# Altium schematic sheet 电子脚铐本体主控板.SchDoc
size A4
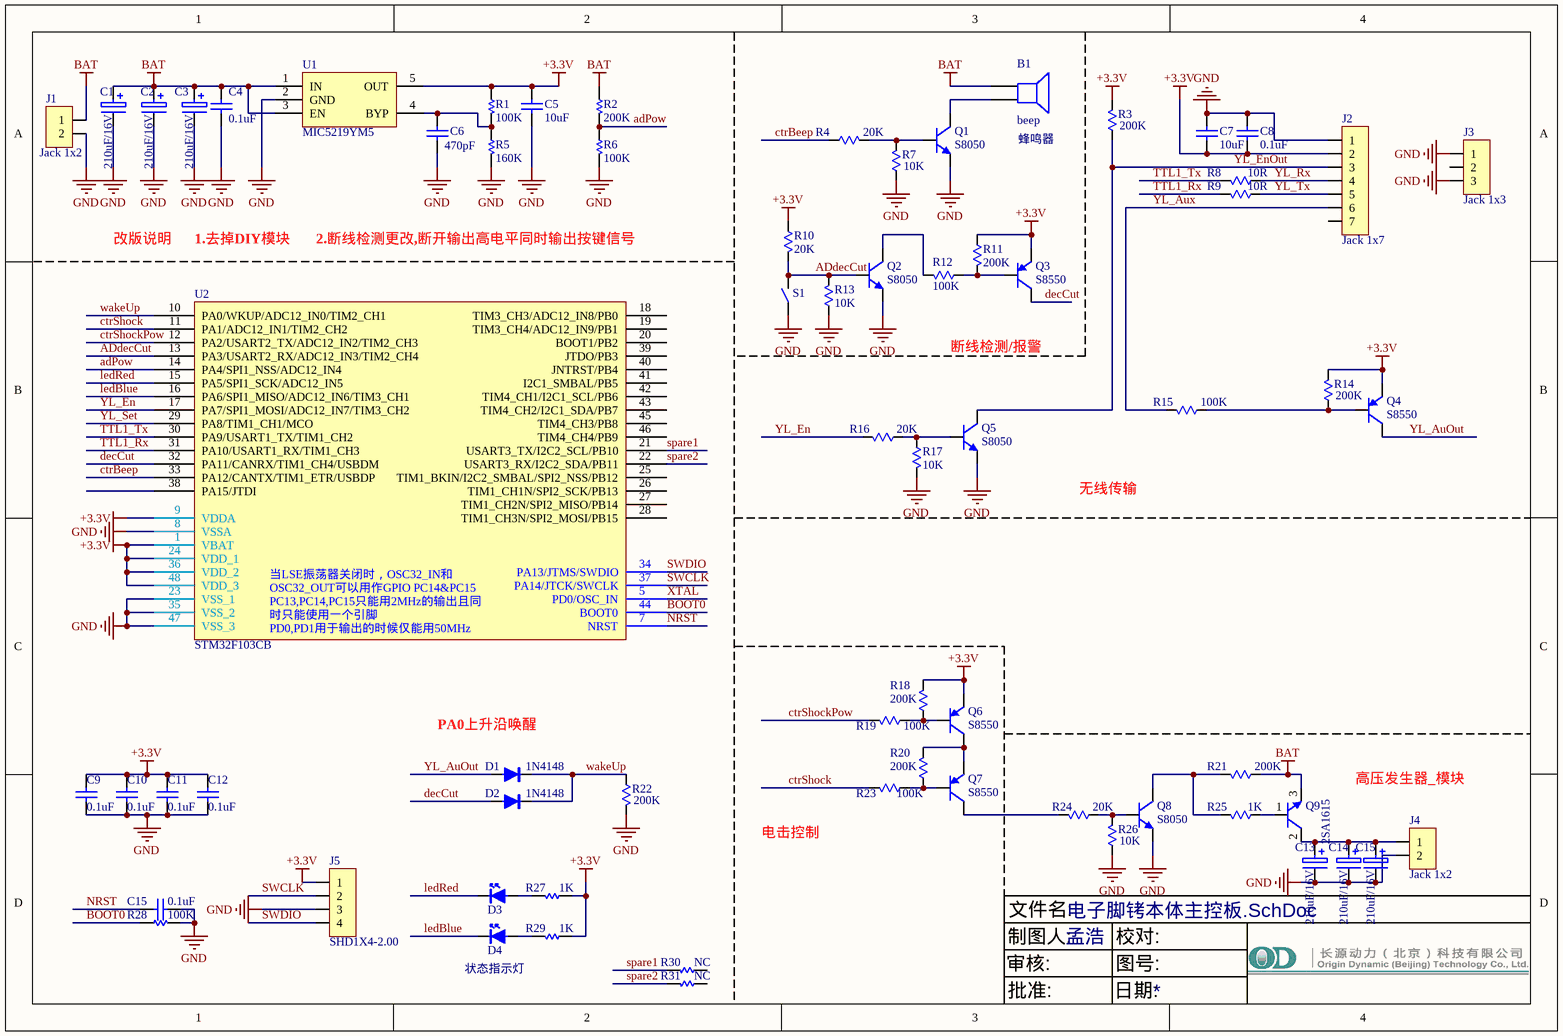
[diagram p0: 电子脚铐本体主控板.SchDoc]

## Parts
(Parts that share a designator on the sheet are numbered #1, #2 ... from top to bottom, then left to right.)
B1  beep  [Jk1*2-2.0]
C1  210uF/16V  [C7343]
C2  210uF/16V  [C7343]
C3  210uF/16V  [C7343]
C4  0.1uF  [C0603]
C5  10uF  [C0603]
C6  470pF  [C0603]
C7  10uF  [C0603]
C8  0.1uF  [C0603]
C9  0.1uF  [C0603]
C10  0.1uF  [C0603]
C11  0.1uF  [C0603]
C12  0.1uF  [C0603]
C13  210uF/16V  [C7343]
C14  210uF/16V  [C7343]
C15#1  210uF/16V  [C7343]
C15#2  0.1uF  [C0603]
D1  1N4148  [SOD-80-S]
D2  1N4148  [SOD-80-S]
D3  LED  [Jk1*2-2.0]  (value not drawn)
D4  LED  [Jk1*2-2.0]  (value not drawn)
J1  Jack 1x2  [HDR1X2]
J2  Jack 1x7  [Jk1*7-2.0]
J3  Jack 1x3  [Jk1*3-2.0]
J4  Jack 1x2  [HDR1X2]
J5  SHD1X4-2.00  [Jk1*4-2.0]
Q1  S8050  [SOT-23]
Q2  S8050  [SOT-23]
Q3  S8550  [SOT-23]
Q4  S8550  [SOT-23]
Q5  S8050  [SOT-23]
Q6  S8550  [SOT-23]
Q7  S8550  [SOT-23]
Q8  S8050  [SOT-23]
Q9  2SA1615  [TO-252]
R1  100K  [R0603]
R2  200K  [R0603]
R3  200K  [R0603]
R4  20K  [R0603]
R5  160K  [R0603]
R6  100K  [R0603]
R7  10K  [R0603]
R8  10R  [R0603]
R9  10R  [R0603]
R10  20K  [R0603]
R11  200K  [R0603]
R12  100K  [R0603]
R13  10K  [R0603]
R14  200K  [R0603]
R15  100K  [R0603]
R16  20K  [R0603]
R17  10K  [R0603]
R18  200K  [R0603]
R19  100K  [R0603]
R20  200K  [R0603]
R21  200K  [R0603]
R22  200K  [R0603]
R23  100K  [R0603]
R24  20K  [R0603]
R25  1K  [R0603]
R26  10K  [R0603]
R27  1K  [R0603]
R28  100K  [R0603]
R29  1K  [R0603]
R30  NC  [R0603]
R31  NC  [R0603]
S1  Switch  [Jk1*2-2.0]  (value not drawn)
U1  MIC5219YM5  [SOT-23-5]
U2  STM32F103CB  [LQFP48]

## Nets
+3.3V: C5.1 C7.1 C8.1 C9.1 C10.1 C11.1 C12.1 J2.2 J5.1 Q3.2(e) Q4.2(e) Q6.2(e) R1.1 R3.2 R10.1 R11.1 R14.2 R18.2 R27.1 R29.1 U1.5(OUT) U2.1(VBAT) U2.9(VDDA) U2.24(VDD_1) U2.36(VDD_2) U2.48(VDD_3)
BAT: B1.1 C1.1 C2.1 C3.1 C4.2 J1.1 Q9.3(E) R2.1 R21.1 U1.1(IN) U1.3(EN)
GND: C1.2 C2.2 C3.2 C4.1 C5.2 C6.2 C7.2 C8.2 C9.2 C10.2 C11.2 C12.2 C13.2 C14.2 C15#1.2 C15#2.2 J1.2 J2.1 J3.1 J3.3 J4.2 J5.3 Q1.2(e) Q2.2(e) Q5.2(e) Q8.2(e) R5.2 R6.2 R7.1 R13.1 R17.2 R22.2 R26.1 R28.2 S1.1 U1.2(GND) U2.8(VSSA) U2.23(VSS_1) U2.35(VSS_2) U2.47(VSS_3)
ADdecCut: Q2.1(b) R10.2 R13.2 S1.2 U2.13(PA3/USART2_RX/ADC12_IN3/TIM2_CH4)
adPow: R2.2 R6.1 U2.14(PA4/SPI1_NSS/ADC12_IN4)
BOOT0: R28.1 U2.44(BOOT0)
ctrBeep: R4.1 U2.33(PA12/CANTX/TIM1_ETR/USBDP)
ctrShock: R23.2 U2.11(PA1/ADC12_IN1/TIM2_CH2)
ctrShockPow: R19.2 U2.12(PA2/USART2_TX/ADC12_IN2/TIM2_CH3)
decCut: D2.1(A) Q3.3(c) U2.32(PA11/CANRX/TIM1_CH4/USBDM)
ledBlue: D4.2(K) U2.16(PA6/SPI1_MISO/ADC12_IN6/TIM3_CH1)
ledRed: D3.2(K) U2.15(PA5/SPI1_SCK/ADC12_IN5)
NRST: C15#2.1 U2.7(NRST)
spare1: R30.2 U2.21(USART3_TX/I2C2_SCL/PB10)
spare2: R31.2 U2.22(USART3_RX/I2C2_SDA/PB11)
SWCLK: J5.2 U2.37(PA14/JTCK/SWCLK)
SWDIO: J5.4 U2.34(PA13/JTMS/SWDIO)
TTL1_Rx: R9.2 U2.31(PA10/USART1_RX/TIM1_CH3)
TTL1_Tx: R8.2 U2.30(PA9/USART1_TX/TIM1_CH2)
wakeUp: D1.2(K) D2.2(K) R22.1 U2.10(PA0/WKUP/ADC12_IN0/TIM2_CH1)
XTAL: U2.5(PD0/OSC_IN)
YL_AuOut: D1.1(A) Q4.3(c)
YL_Aux: J2.6 R15.2
YL_En: R16.2 U2.17(PA7/SPI1_MOSI/ADC12_IN7/TIM3_CH2)
YL_EnOut: J2.3 Q5.3(c) R3.1
YL_Rx: J2.4 R8.1
YL_Set: U2.29(PA8/TIM1_CH1/MCO)
YL_Tx: J2.5 R9.1
NetB1_2: B1.2 Q1.3(c)
NetC6_1: C6.1 R1.2 R5.1 U1.4(BYP)
NetC13_1: C13.1 C14.1 C15#1.1 J4.1 Q9.2(C)
NetD3_1: D3.1(A) R27.2
NetD4_1: D4.1(A) R29.2
NetQ1_1: Q1.1(b) R4.2 R7.2
NetQ2_3: Q2.3(c) R12.2
NetQ3_1: Q3.1(b) R11.2 R12.1
NetQ4_1: Q4.1(b) R14.1 R15.1
NetQ5_1: Q5.1(b) R16.1 R17.1
NetQ6_1: Q6.1(b) R18.1 R19.1
NetQ6_3: Q6.3(c) Q7.2(e) R20.2
NetQ7_1: Q7.1(b) R20.1 R23.1
NetQ7_3: Q7.3(c) R24.2
NetQ8_1: Q8.1(b) R24.1 R26.2
NetQ8_3: Q8.3(c) R21.2 R25.2
NetQ9_1: Q9.1(B) R25.1

Not connected (* = marked no-connect by the designer): J2 7; J3 2; R30 1; R31 1; U2 2(PC13-TAMPER-RTC) 3(PC14-OSC32_IN) 4(PC15-OSC32_OUT) 6(PD1/OSC_OUT) 18(TIM3_CH3/ADC12_IN8/PB0) 19(TIM3_CH4/ADC12_IN9/PB1) 20(BOOT1/PB2) 25(TIM1_BKIN/I2C2_SMBAL/SPI2_NSS/PB12) 26(TIM1_CH1N/SPI2_SCK/PB13) 27(TIM1_CH2N/SPI2_MISO/PB14) 28(TIM1_CH3N/SPI2_MOSI/PB15) 38(PA15/JTDI) 39(JTDO/PB3) 40(JNTRST/PB4) 41(I2C1_SMBAL/PB5) 42(TIM4_CH1/I2C1_SCL/PB6) 43(TIM4_CH2/I2C1_SDA/PB7) 45(TIM4_CH3/PB8) 46(TIM4_CH4/PB9)

## Notes on the sheet
- (near B1) 蜂鸣器
- 改版说明
- 1.去掉DIY模块
- 2.断线检测更改,断开输出高电平同时输出按键信号
- 断线检测/报警
- 无线传输
- (near D1) PA0上升沿唤醒
- 高压发生器_模块
- 电击控制
- (near D4) 状态指示灯
- 文件名:
- 审核:
- 制图人:
- 孟浩
- 校对:
- 图号:
- 批准:
- 日期:
- (in symbol STM32F103Cx) OSC32_IN和OSC32_OUT可以用作通用IO PC14和PC15; PC13,PC14,PC15只能用于2MHz的输出模式且同时只能使用一个引脚; 当LSE振荡器关闭时，OSC32_IN和OSC32_OUT可以用作GPIO PC14&PC15 / PC13,PC14,PC15只能用2MHz的输出且同时只能使用一个引脚 / PD0,PD1用于输出的时候仅能用50MHz

## Library data of the parts
B1 = Speaker: Loudspeaker; Published: 24-Mar-1999; LatestRevisionDate: 17-Jul-2002; LatestRevisionNote: Re-released for DXP Platform.; PackageReference: PIN2; Publisher: Altium Limited
C1-C3 C13 C14 C15#1 = Cap Poll
C4 C9-C12 C15#2 = Cap Semi
C5-C8 = CAP: Published: 8-Jun-2000; LatestRevisionDate: 17-Jul-2002; LatestRevisionNote: Re-released for DXP Platform.; PackageReference: RAD-0.3; Publisher: Altium Limited
  C5 C7: Value: 10uF
  C8: Value: 0.1uF
D1 D2 = DIODE-SWITCHING: Silicon Epitaxial Planar Diodes
J1 J4 = Jack 1x2: 插座
J2 = Jack 1x7: 插座
J3 = Jack 1x3: 插座
J5 = HEADER1X4
Q1 Q2 Q5 Q8 = S8050: NPN triode, 0.5A Max
Q3 Q4 Q6 Q7 = S8550: PNP triode
Q9 = MJD122
R1 R2 R5 R6 R27-R31 = Res
R3 R4 R7-R26 = RES: Resistor; Published: 8-Jun-2000; LatestRevisionDate: 17-Jul-2002; LatestRevisionNote: Re-released for DXP Platform.; PackageReference: AXIAL-0.3; Publisher: Altium Limited
  R8 R9: Value: 10R
  R10: Value: 20K
  R11: Value: 200K
  R12: Value: 100K
  R13: Value: 10K
S1 = Sw
U1 = MIC5205
U2 = STM32F103Cx